# EAGLE design coracao2 (EAGLE 7.4.0)
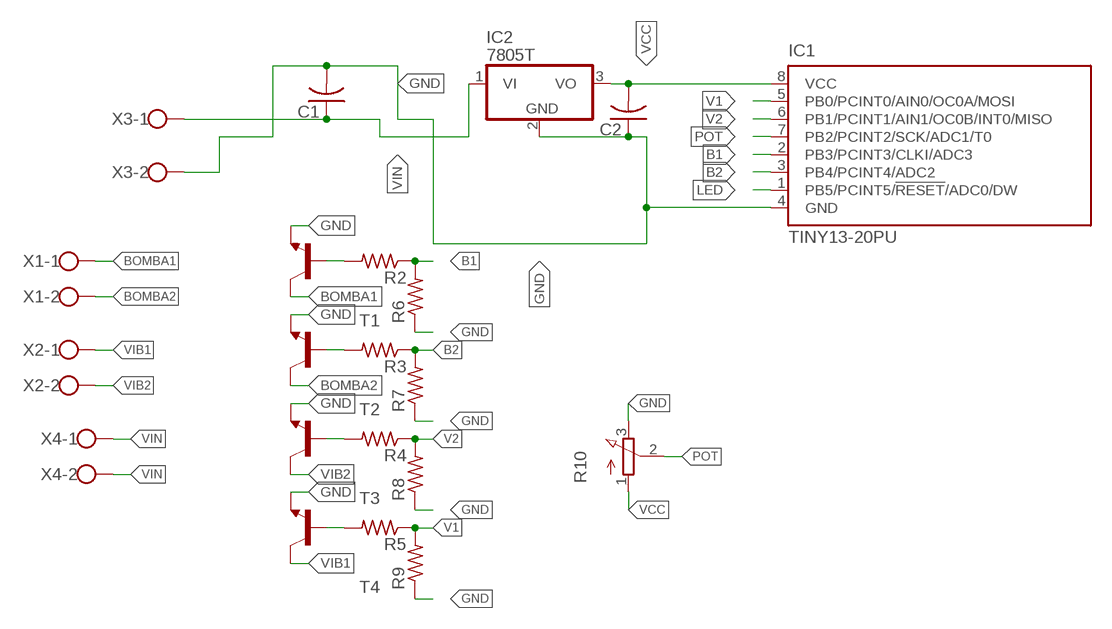
[diagram p0: schematic, sheet 1]

## Parts
C1  C-US025-025X050  [C025-025X050]
C2  C-US025-025X050  [C025-025X050]
IC1  TINY13-20PU  [DIL08]
IC2  7805T  [TO220H]
R2  R-US_0207/9  [0207/9]
R3  R-US_0207/9  [0207/9]
R4  R-US_0207/9  [0207/9]
R5  R-US_0207/9  [0207/9]
R6  R-US_0207/9  [0207/9]
R7  R-US_0207/9  [0207/9]
R8  R-US_0207/9  [0207/9]
R9  R-US_0207/9  [0207/9]
R10  3RP/1610N  [3RP/1610N]
T1  -NPN-TO220V  [TO220V]
T2  -NPN-TO220V  [TO220V]
T3  -NPN-TO220V  [TO220V]
T4  -NPN-TO220V  [TO220V]
X1  W237-102  [W237-102]
X2  W237-102  [W237-102]
X3  W237-102  [W237-102]
X4  W237-102  [W237-102]

## Nets
B1: IC1.2(PB3/PCINT3/CLKI/ADC3) R2.1 R6.2
B2: IC1.3(PB4/PCINT4/ADC2) R3.1 R4.2 R7.2 T3.1(B)
BOMBA1: T1.2(C) X1.1
BOMBA2: T2.2(C) X1.2
GND: C1.2 C2.1 IC1.4(GND) IC2.2(GND) R6.1 R7.1 R8.1 R9.1 R10.3(E) T1.3(E) T2.3(E) T3.3(E) T4.3(E) X3.2
LED: IC1.1(PB5/PCINT5/!RESET!/ADC0/DW)
N$1: R2.2 T1.1(B)
N$3: R3.2 T2.1(B)
N$4: R5.2 T4.1(B)
POT: IC1.7(PB2/PCINT2/SCK/ADC1/T0) R10.2(S)
V1: IC1.5(PB0/PCINT0/AIN0/OC0A/MOSI) R5.1 R9.2
V2: IC1.6(PB1/PCINT1/AIN1/OC0B/INT0/MISO) R4.1 R8.2
VCC: C2.2 IC1.8(VCC) IC2.3(VO) R10.1(A)
VIB1: T4.2(C) X2.1
VIB2: T3.2(C) X2.2
VIN: C1.1 IC2.1(VI) X3.1 X4.1 X4.2

## Library data of the parts
C1 C2 = adafruit:C-US: CAPACITOR, American symbol
IC1 = atmel:TINY13: 8-bit AVR Microcontroller with 1K Bytes In-System Programmable Flash Source: http://www.atmel.com/dyn/resources/prod_documents/2535S.pdf; MPN: ATTINY13-20PU; OC_FARNELL: 9171550; OC_NEWARK: 96K6521
IC2 = adafruit:78*: Positive VOLTAGE REGULATOR Added bigger pads to the TO-92 package
R2-R9 = adafruit:R-US_: RESISTOR, American symbol
R10 = pot:3RP/1610N: 16mm Potentiometer one level Source: http://www.alphapotentiometers.net/html/16mm_pot_2.html
T1-T4 = transistor:*-NPN-: NPN Transistror BF959 corrected 2008.03.06
X1-X4 = con-wago-500:W237-102: WAGO SCREW CLAMP; MPN: 237-102; OC_FARNELL: unknown; OC_NEWARK: 70K9898

## Board
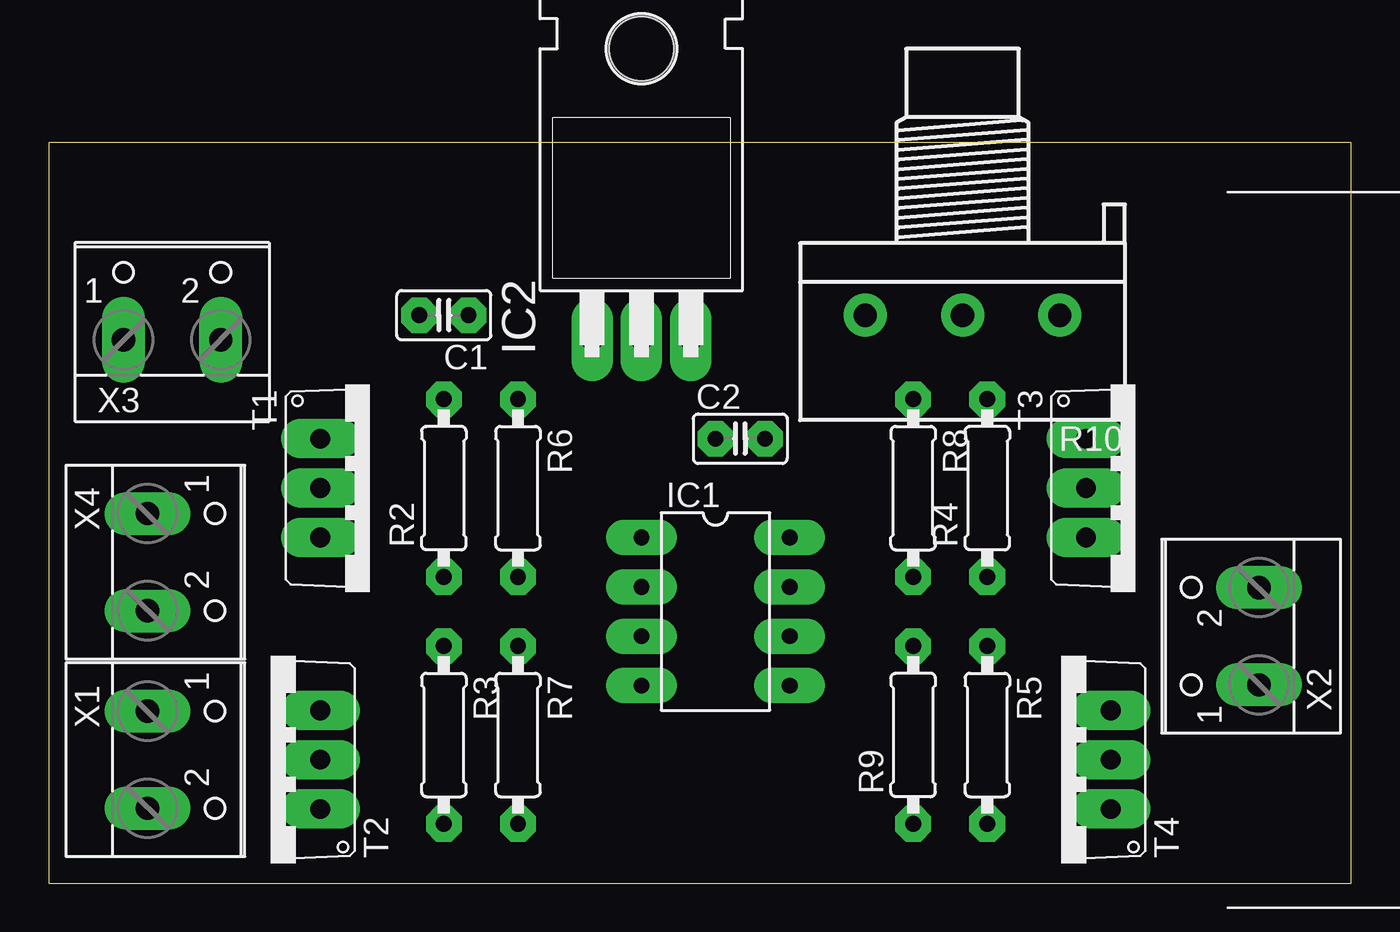
[diagram p1: board, top side]
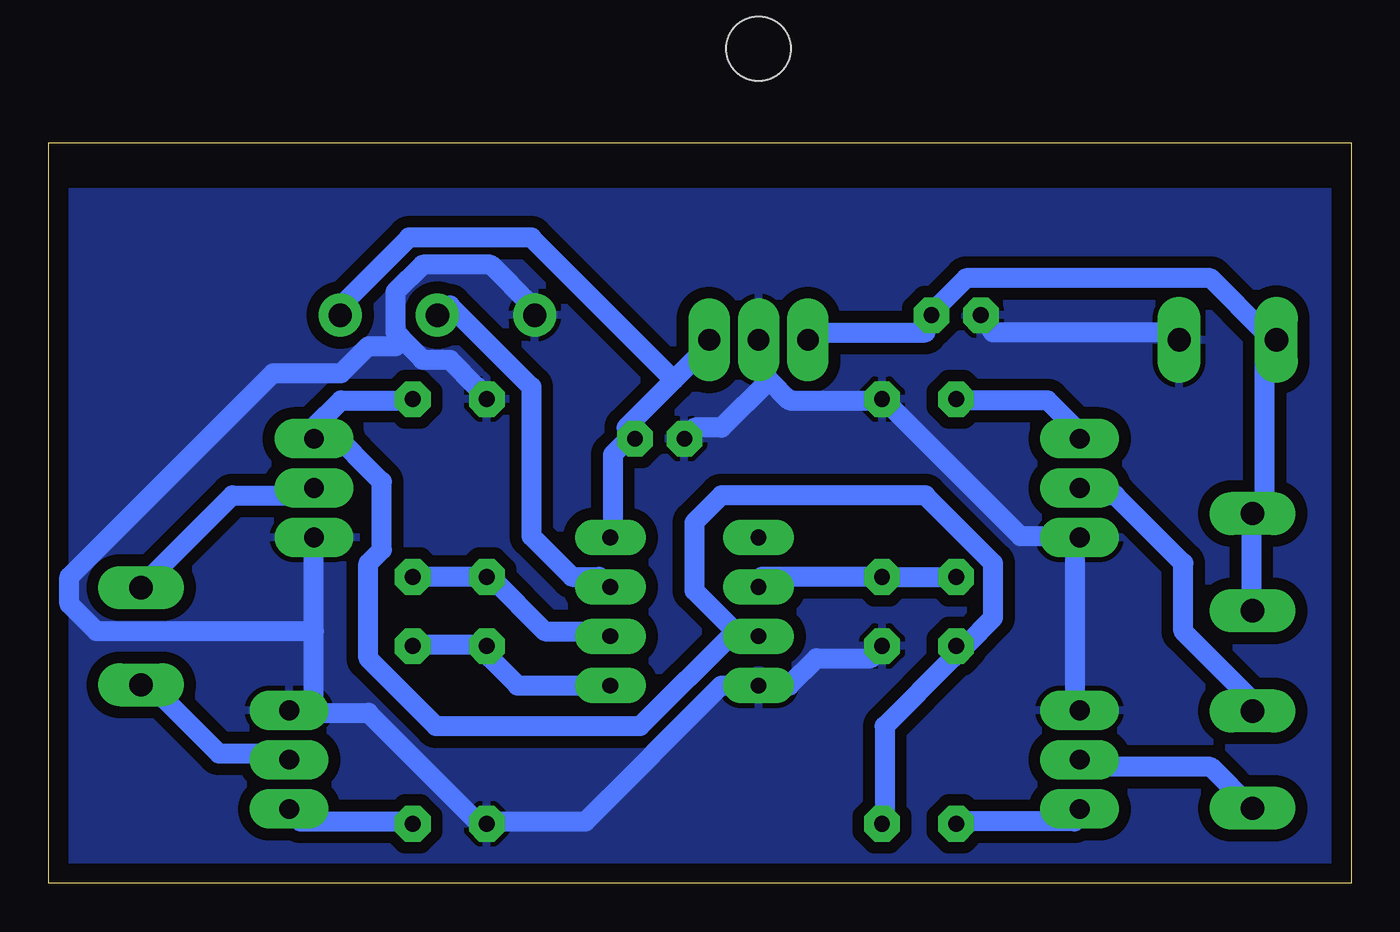
[diagram p2: board, bottom side, seen from below]

Size 66.98 x 38.09 mm. Coordinates in mm from the lower left corner, seen from the top.
Outline: 0,0 66.98,0 66.98,38.09 0,38.09 0,0
Copper layers 16: Bottom 0.035mm
Design rules "default *": minimum track width 40mil, minimum drill 20mil, track to track 15mil, track to pad 15mil, pad to pad 15mil, via to via 15mil, smd to smd 8mil, copper to edge 40mil, drill to drill 8mil, minimum pad ring 20mil, minimum via ring 8mil, stop-mask expansion 4mil, vias tented up to drill 0mil, thermal gap 10mil

### Footprints (pad centres in the part's own frame; a part is rotated, then mirrored left to right if it is on the bottom)
C025-025X050 = drill 0.813 pad 1.676 octagon: 1 -1.27,0; 2 1.27,0
DIL08 = drill 0.813 long: 1 -3.81,-3.81; 2 -1.27,-3.81; 3 1.27,-3.81; 4 3.81,-3.81; 5 3.81,3.81; 6 1.27,3.81; 7 -1.27,3.81; 8 -3.81,3.81
TO220H = drill 1.118 long: 1 -2.54,-10.16; 2 0,-10.16; 3 2.54,-10.16 | hole 3.302: 0,4.826
0207/9 = drill 0.813 pad 1.676 octagon: 1 -4.572,0; 2 4.572,0
3RP/1610N = drill 1.2 pad 2.184: 1 -5,0; 2 0,0; 3 5,0
TO220V = drill 1.016 long: 1 -2.54,-2.54; 2 0,-2.54; 3 2.54,-2.54
W237-102 = drill 1.194 long: 1 -2.5,-1.27; 2 2.5,-1.27

### Placement (x,y rotation side)
C1  20.32,29.21 180 top
C2  35.56,22.86 0 top
IC1  34.29,13.97 270 top
IC2  30.48,38.1 0 top
R2  20.32,20.32 90 top
R3  20.32,7.62 270 top
R4  48.26,20.32 90 top
R5  48.26,7.62 270 top
R6  24.13,20.32 270 top
R7  24.13,7.62 270 top
R8  44.45,20.32 270 top
R9  44.45,7.62 90 top
R10  46.99,29.21 180 top
T1  16.51,20.32 270 top
T2  11.43,6.35 90 top
T3  55.88,20.32 270 top
T4  52.07,6.35 90 top
X1  6.35,6.35 270 top
X2  60.96,12.7 90 top
X3  6.35,29.21 0 top
X4  6.35,16.51 270 top

### Tracks (layer width: path | path; a pad name or v marks a point on that pad's centre or on a via)
B1
  Bottom 1.016: R2.1 R6.2 30.29,15.75 IC1.2
B2
  Bottom 1.016: R4.2 48.45,24.83 51.94,24.83 53.34,23.43 T3.1 52.64,23.43 49.85,20.64 49.85,17.14 50.55,16.45 50.55,11.56 47.05,8.06 36.58,8.06 31.69,12.95 | R7.2 24,3.18 24,8.06 20.51,11.56 R3.1 19.81,12.26 18.41,13.65 18.41,16.45 21.91,19.94 32.38,19.94 33.78,18.54 33.78,15.05 31.69,12.95 | 31.69,12.95 30.99,12.95 IC1.3 31.69,12.95
BOMBA1
  Bottom 1.016: T1.2 13.53,19.94 12.13,19.94 8.64,16.45 8.64,12.95 5.14,9.46 X1.1
BOMBA2
  Bottom 1.016: T2.2 13.53,5.97 7.24,5.97 5.14,3.87 X1.2
GND
  Bottom 1.016: C1.2 18.41,28.32 9.33,28.32 X3.2 | 48.8,27.97 49.15,28.32 49.15,30.42 47.75,31.81 44.26,31.81 42.16,29.72 R10.3 | 48.8,27.97 47.75,26.92 46.36,26.92 44.96,25.53 R8.1 | R7.1 24.7,11.56 27.5,11.56 28.89,10.16 IC1.4 32.38,10.16 39.37,3.18 44.26,3.18 R9.1 44.96,3.18 50.55,8.76 53.34,8.76 | 53.34,8.76 54.04,8.76 T4.3 53.34,8.76 | 53.34,8.76 53.34,12.95 | 53.34,12.95 T3.3 | 53.34,12.95 64.52,12.95 65.91,14.35 65.91,15.75 55.44,26.23 51.94,26.23 50.55,27.62 49.15,27.62 48.8,27.97 | T2.3 14.22,9.46 14.22,17.14 T1.3 14.22,17.84 17.02,17.84 24,24.83 R6.1 24.7,24.83 28.89,24.83 29.94,25.88 | 29.94,25.88 30.29,26.23 30.29,27.62 IC2.2 | 29.94,25.88 32.38,23.43 33.78,23.43 C2.1
  pour Bottom (isolate 0.61): 0,35.56 0,0 67.31,0 67.31,35.56
N$1
  Bottom 1.016: R2.2 19.81,24.83 15.62,24.83 14.22,23.43 T1.1
N$3
  Bottom 1.016: R3.2 19.81,3.18 14.22,3.18 T2.1
N$4
  Bottom 1.016: R5.2 48.45,3.18 54.04,3.18 T4.1
POT
  Bottom 1.016: IC1.7 38.67,15.75 40.07,15.75 42.16,17.84 42.16,25.53 46.36,29.72 R10.2
V1
  Bottom 1.016: IC1.5 42.86,10.16 44.26,11.56 R9.2 44.96,12.26 47.75,12.26 R5.1
V2
  Bottom 1.016: IC1.6 38.67,12.95 41.47,12.95 44.26,15.75 R8.2 R4.1
VCC
  Bottom 1.016: IC1.8 37.97,17.84 37.97,22.04 37.27,22.73 C2.2 37.27,23.43 34.83,25.88 | 34.83,25.88 33.08,27.62 IC2.3 | 34.83,25.88 42.16,33.21 48.45,33.21 51.94,29.72 R10.1
VIB1
  Bottom 1.016: T4.2 54.74,6.67 58.23,6.67 61.72,10.16 X2.1
VIB2
  Bottom 1.016: T3.2 53.34,19.94 57.53,19.94 61.72,15.75 X2.2
VIN
  Bottom 1.016: IC2.1 27.5,28.32 21.91,28.32 C1.1 21.21,29.72 19.81,31.11 7.24,31.11 4.45,28.32 X3.1 4.45,27.62 4.45,19.24 X4.1 5.14,18.54 5.14,14.35 X4.2